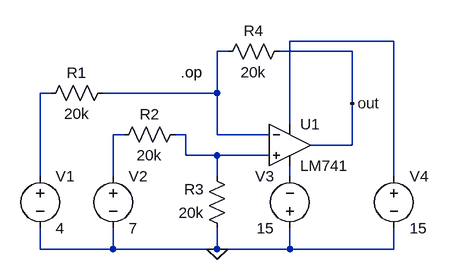
[diagram p0: schematic 8-sub.asc]
8-sub.asc, the LTspice schematic file:
Version 4.1
SHEET 1 880 680
WIRE 384 0 224 0
WIRE 128 16 112 16
WIRE 320 16 208 16
WIRE -144 80 -160 80
WIRE 112 80 112 16
WIRE 112 80 -64 80
WIRE 320 96 320 16
WIRE 224 128 224 0
WIRE -32 144 -48 144
WIRE 64 144 48 144
WIRE 112 144 112 80
WIRE 192 144 112 144
WIRE 320 160 320 96
WIRE 320 160 256 160
WIRE 64 176 64 144
WIRE 112 176 64 176
WIRE 192 176 112 176
WIRE -160 208 -160 80
WIRE -48 208 -48 144
WIRE 112 208 112 176
WIRE 224 208 224 192
WIRE 384 208 384 0
WIRE -160 320 -160 288
WIRE -48 320 -48 288
WIRE -48 320 -160 320
WIRE 112 320 112 288
WIRE 112 320 -48 320
WIRE 224 320 224 288
WIRE 224 320 112 320
WIRE 384 320 384 288
WIRE 384 320 224 320
FLAG 320 96 out
FLAG 112 320 0
SYMBOL LM741 224 96 R0
SYMATTR InstName U1
SYMBOL res 224 0 R90
WINDOW 0 0 56 VBottom 2
WINDOW 3 32 56 VTop 2
SYMATTR InstName R4
SYMATTR Value 20k
SYMBOL voltage 224 304 R180
WINDOW 0 24 96 Left 2
WINDOW 3 24 16 Left 2
SYMATTR InstName V3
SYMATTR Value 15
SYMBOL voltage 384 192 R0
SYMATTR InstName V4
SYMATTR Value 15
SYMBOL res 64 128 R90
WINDOW 0 0 56 VBottom 2
WINDOW 3 32 56 VTop 2
SYMATTR InstName R2
SYMATTR Value 20k
SYMBOL res -48 64 R90
WINDOW 0 0 56 VBottom 2
WINDOW 3 32 56 VTop 2
SYMATTR InstName R1
SYMATTR Value 20k
SYMBOL voltage -48 192 R0
SYMATTR InstName V2
SYMATTR Value 7
SYMBOL voltage -160 192 R0
SYMATTR InstName V1
SYMATTR Value 4
SYMBOL res 128 304 R180
WINDOW 0 36 76 Left 2
WINDOW 3 36 40 Left 2
SYMATTR InstName R3
SYMATTR Value 20k
TEXT 56 48 Left 2 !.op

The netlist it stands for:
* 8-sub.asc
X§U1 N005 N002 N001 N006 out LM741  ; pins In+ In- V+ V- OUT
R4 out N002 20k
V3 0 N006 15
V4 N001 0 15
R2 N005 N004 20k
R1 N002 N003 20k
V2 N004 0 7
V1 N003 0 4
R3 0 N005 20k
.op
.lib LM741.lib
.backanno
.end